# EAGLE design pet_csadapter-v1.1a (EAGLE 4.15)
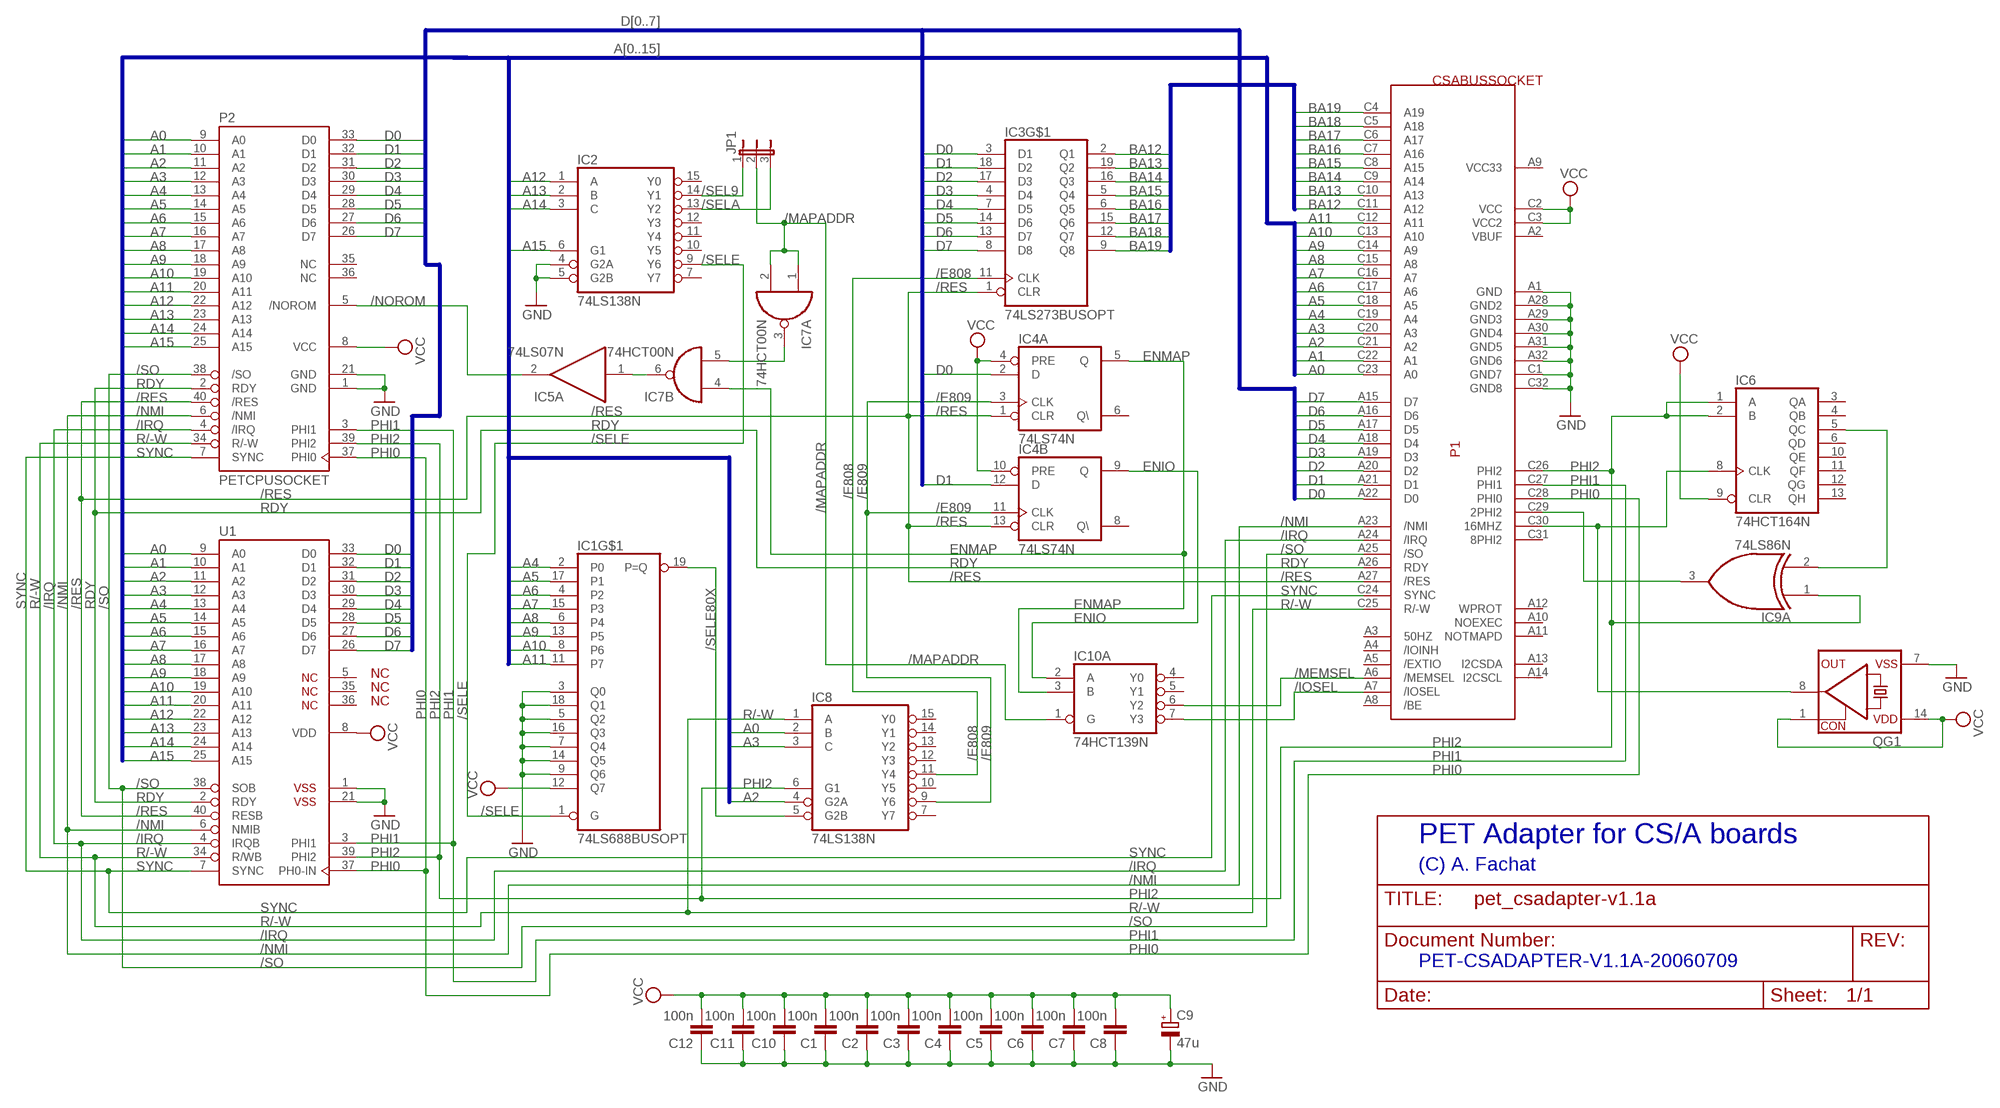
[diagram p0: schematic, sheet 1]

## Parts
C1  100n  C-EU025-025X050  [C025-025X050]
C2  100n  C-EU025-025X050  [C025-025X050]
C3  100n  C-EU025-025X050  [C025-025X050]
C4  100n  C-EU025-025X050  [C025-025X050]
C5  100n  C-EU025-025X050  [C025-025X050]
C6  100n  C-EU025-025X050  [C025-025X050]
C7  100n  C-EU025-025X050  [C025-025X050]
C8  100n  C-EU025-025X050  [C025-025X050]
C9  47u  CPOL-EUE2.5-5  [E2,5-5]
C10  100n  C-EU025-025X050  [C025-025X050]
C11  100n  C-EU025-025X050  [C025-025X050]
C12  100n  C-EU025-025X050  [C025-025X050]
IC1  74LS688BUSOPT  [DIL20]
IC2  74LS138N  [DIL16]
IC3  74LS273BUSOPT  [DIL20]
IC4  74LS74N  [DIL14]
IC5  74LS07N  [DIL14]
IC6  74HCT164N  [DIL14]
IC7  74HCT00N  [DIL14]
IC8  74LS138N  [DIL16]
IC9  74LS86N  [DIL14]
IC10  74HCT139N  [DIL16]
JP1  JP2E  [JP2]
P1  CSABUSSOCKET  [CSABUSSOCK]
P2  PETCPUSOCKET  [DIL40]
QG1  CRYSTAL_RES-SG51  [SG51]
U1  G65SC02P  [DIP-40]

## Nets
/E808: IC3.11(CLK) IC8.11(Y4)
/E809: IC4.3(A:CLK) IC4.11(B:CLK) IC8.9(Y6)
/IOSEL: IC10.7(A:Y3) P1.A7(/IOSEL)
/IRQ: P1.A24(/IRQ) P2.4(/IRQ) U1.4(IRQB)
/MAPADDR: IC7.1(A:I0) IC7.2(A:I1) IC10.1(A:G) JP1.2
/MEMSEL: IC10.6(A:Y2) P1.A6(/MEMSEL)
/NMI: P1.A23(/NMI) P2.6(/NMI) U1.6(NMIB)
/NOROM: IC5.2(A:O) P2.5(/NOROM)
/RES: IC3.1(CLR) IC4.1(A:CLR) IC4.13(B:CLR) P1.A27(/RES) P2.40(/RES) U1.40(RESB)
/SEL9: IC2.14(Y1) JP1.1
/SELA: IC2.13(Y2) JP1.3
/SELE: IC1.1(G) IC2.9(Y6)
/SELE80X: IC1.19(P=Q) IC8.5(G2B)
/SO: P1.A25(/SO) P2.38(/SO) U1.38(SOB)
A0: IC8.2(B) P1.C23(A0) P2.9(A0) U1.9(A0)
A1: P1.C22(A1) P2.10(A1) U1.10(A1)
A2: IC8.4(G2A) P1.C21(A2) P2.11(A2) U1.11(A2)
A3: IC8.3(C) P1.C20(A3) P2.12(A3) U1.12(A3)
A4: IC1.2(P0) P1.C19(A4) P2.13(A4) U1.13(A4)
A5: IC1.17(P1) P1.C18(A5) P2.14(A5) U1.14(A5)
A6: IC1.4(P2) P1.C17(A6) P2.15(A6) U1.15(A6)
A7: IC1.15(P3) P1.C16(A7) P2.16(A7) U1.16(A7)
A8: IC1.6(P4) P1.C15(A8) P2.17(A8) U1.17(A8)
A9: IC1.13(P5) P1.C14(A9) P2.18(A9) U1.18(A9)
A10: IC1.8(P6) P1.C13(A10) P2.19(A10) U1.19(A10)
A11: IC1.11(P7) P1.C12(A11) P2.20(A11) U1.20(A11)
A12: IC2.1(A) P2.22(A12) U1.22(A12)
A13: IC2.2(B) P2.23(A13) U1.23(A13)
A14: IC2.3(C) P2.24(A14) U1.24(A14)
A15: IC2.6(G1) P2.25(A15) U1.25(A15)
BA12: IC3.2(Q1) P1.C11(A12)
BA13: IC3.19(Q2) P1.C10(A13)
BA14: IC3.16(Q3) P1.C9(A14)
BA15: IC3.5(Q4) P1.C8(A15)
BA16: IC3.6(Q5) P1.C7(A16)
BA17: IC3.15(Q6) P1.C6(A17)
BA18: IC3.12(Q7) P1.C5(A18)
BA19: IC3.9(Q8) P1.C4(A19)
D0: IC3.3(D1) IC4.2(A:D) P1.A22(D0) P2.33(D0) U1.33(D0)
D1: IC3.18(D2) IC4.12(B:D) P1.A21(D1) P2.32(D1) U1.32(D1)
D2: IC3.17(D3) P1.A20(D2) P2.31(D2) U1.31(D2)
D3: IC3.4(D4) P1.A19(D3) P2.30(D3) U1.30(D3)
D4: IC3.7(D5) P1.A18(D4) P2.29(D4) U1.29(D4)
D5: IC3.14(D6) P1.A17(D5) P2.28(D5) U1.28(D5)
D6: IC3.13(D7) P1.A16(D6) P2.27(D6) U1.27(D6)
D7: IC3.8(D8) P1.A15(D7) P2.26(D7) U1.26(D7)
ENIO: IC4.9(B:Q) IC10.2(A:A)
ENMAP: IC4.5(A:Q) IC7.4(B:I0) IC10.3(A:B)
GND: C1.1 C2.1 C3.1 C4.1 C5.1 C6.1 C7.1 C8.1 C9.- C10.1 C11.1 C12.1 IC1.3(Q0) IC1.5(Q2) IC1.7(Q4) IC1.9(Q6) IC1.14(Q5) IC1.16(Q3) IC1.18(Q1) IC2.4(G2A) IC2.5(G2B) P1.A1(GND) P1.A28(GND2) P1.A29(GND3) P1.A30(GND4) P1.A31(GND5) P1.A32(GND6) P1.C1(GND7) P1.C32(GND8) P2.1(GND) P2.21(GND) QG1.7(VSS) U1.1(VSS$1) U1.21(VSS$2)
N$1: IC6.8(CLK) P1.C30(16MHZ) QG1.8(OUT)
N$4: IC9.3(A:O) P1.C29(2PHI2)
N$5: IC6.5(QC) IC9.2(A:I1)
N$7: IC5.1(A:I) IC7.6(B:O)
N$9: IC7.3(A:O) IC7.5(B:I1)
PHI0: P1.C28(PHI0) P2.37(PHI0) U1.37(PH0-IN)
PHI1: P1.C27(PHI1) P2.3(PHI1) U1.3(PHI1)
PHI2: IC6.1(A) IC6.2(B) IC8.6(G1) IC9.1(A:I0) P1.C26(PHI2) P2.39(PHI2) U1.39(PHI2)
R/-W: IC8.1(A) P1.C25(R/-W) P2.34(R/-W) U1.34(R/WB)
RDY: P1.A26(RDY) P2.2(RDY) U1.2(RDY)
SYNC: P1.C24(SYNC) P2.7(SYNC) U1.7(SYNC)
VCC: C1.2 C2.2 C3.2 C4.2 C5.2 C6.2 C7.2 C8.2 C9.+ C10.2 C11.2 C12.2 IC1.12(Q7) IC4.4(A:PRE) IC4.10(B:PRE) IC6.9(CLR) P1.C2(VCC) P1.C3(VCC2) P2.8(VCC) QG1.1(CON) QG1.14(VDD) U1.8(VDD)
Unconnected: IC2.7(Y7) IC2.10(Y5) IC2.11(Y4) IC2.12(Y3) IC2.15(Y0) IC4.6(A:Q\) IC4.8(B:Q\) IC5.3(B:I) IC5.4(B:O) IC5.5(C:I) IC5.6(C:O) IC5.8(D:O) IC5.9(D:I) IC5.10(E:O) IC5.11(E:I) IC5.12(F:O) IC5.13(F:I) IC6.3(QA) IC6.4(QB) IC6.6(QD) IC6.10(QE) IC6.11(QF) IC6.12(QG) IC6.13(QH) IC7.8(C:O) IC7.9(C:I0) IC7.10(C:I1) IC7.11(D:O) IC7.12(D:I0) IC7.13(D:I1) IC8.7(Y7) IC8.10(Y5) IC8.12(Y3) IC8.13(Y2) IC8.14(Y1) IC8.15(Y0) IC9.4(B:I0) IC9.5(B:I1) IC9.6(B:O) IC9.8(C:O) IC9.9(C:I0) IC9.10(C:I1) IC9.11(D:O) IC9.12(D:I0) IC9.13(D:I1) IC10.4(A:Y0) IC10.5(A:Y1) IC10.9(B:Y3) IC10.10(B:Y2) IC10.11(B:Y1) IC10.12(B:Y0) IC10.13(B:B) IC10.14(B:A) IC10.15(B:G) P1.A2(VBUF) P1.A3(50HZ) P1.A4(/IOINH) P1.A5(/EXTIO) P1.A8(/BE) P1.A9(VCC33) P1.A10(NOEXEC) P1.A11(NOTMAPD) P1.A12(WPROT) P1.A13(I2CSDA) P1.A14(I2CSCL) P1.C31(8PHI2) P2.35(NC) P2.36(NC) U1.5(NC$1) U1.35(NC$2) U1.36(NC$3)

## Buses
D[0..7]
A[0..15]
BA[12..19]

## Notes on the sheet
- PET Adapter for CS/A boards
- (C) A. Fachat
- PET-CSADAPTER-V1.1A-20060709

## Power pins joined to a net without a drawn wire
GND: IC1.10(GND) IC2.8(GND) IC3.10(GND) IC4.7(P:GND) IC5.7(P:GND) IC6.7(GND) IC7.7(P:GND) IC8.8(GND) IC9.7(P:GND) IC10.8(P:GND)
VCC: IC1.20(VCC) IC2.16(VCC) IC3.20(VCC) IC4.14(P:VCC) IC5.14(P:VCC) IC6.14(VCC) IC7.14(P:VCC) IC8.16(VCC) IC9.14(P:VCC) IC10.16(P:VCC)

## Library data of the parts
C1-C8 C10-C12 = rcl:C-EU: CAPACITOR, European symbol
C9 = rcl:CPOL-EU: POLARIZED CAPACITOR, European symbol
IC1 = csa:74LS688BUSOPT
IC2 IC8 = 74xx-us:74*138: 3-line to 8-line DECODER/DEMULTIPLEXER
IC3 = csa:74LS273BUSOPT
IC4 = 74xx-us:74*74: Dual D type positive edge triggered FLIP FLOP, preset and clear
IC5 = 74xx-eu:74*07: Hex BUFFER, open collector high-voltage output
IC6 = 74xx-eu:74*164: 8-bit parallel out SHIFT REGISTER
IC7 = 74xx-eu:74*00: Quad 2-input NAND gate
IC9 = 74xx-us:74*86: Quad 2-input EXCLUSIV-OR (XOR) gate
IC10 = 74xx-eu:74*139: Dual 2-line to 4-line DECODER/DEMULTIPLEXER
JP1 = jumper:JP2E: JUMPER
P1 = csa:CSABUS
P2 = csa:PETCPUSOCKET
QG1 = crystal:CRYSTAL_RES-: CRYSTAL RESONATOR
U1 = 65xxx:G65SC02P: California Micro Devices Version

## Board
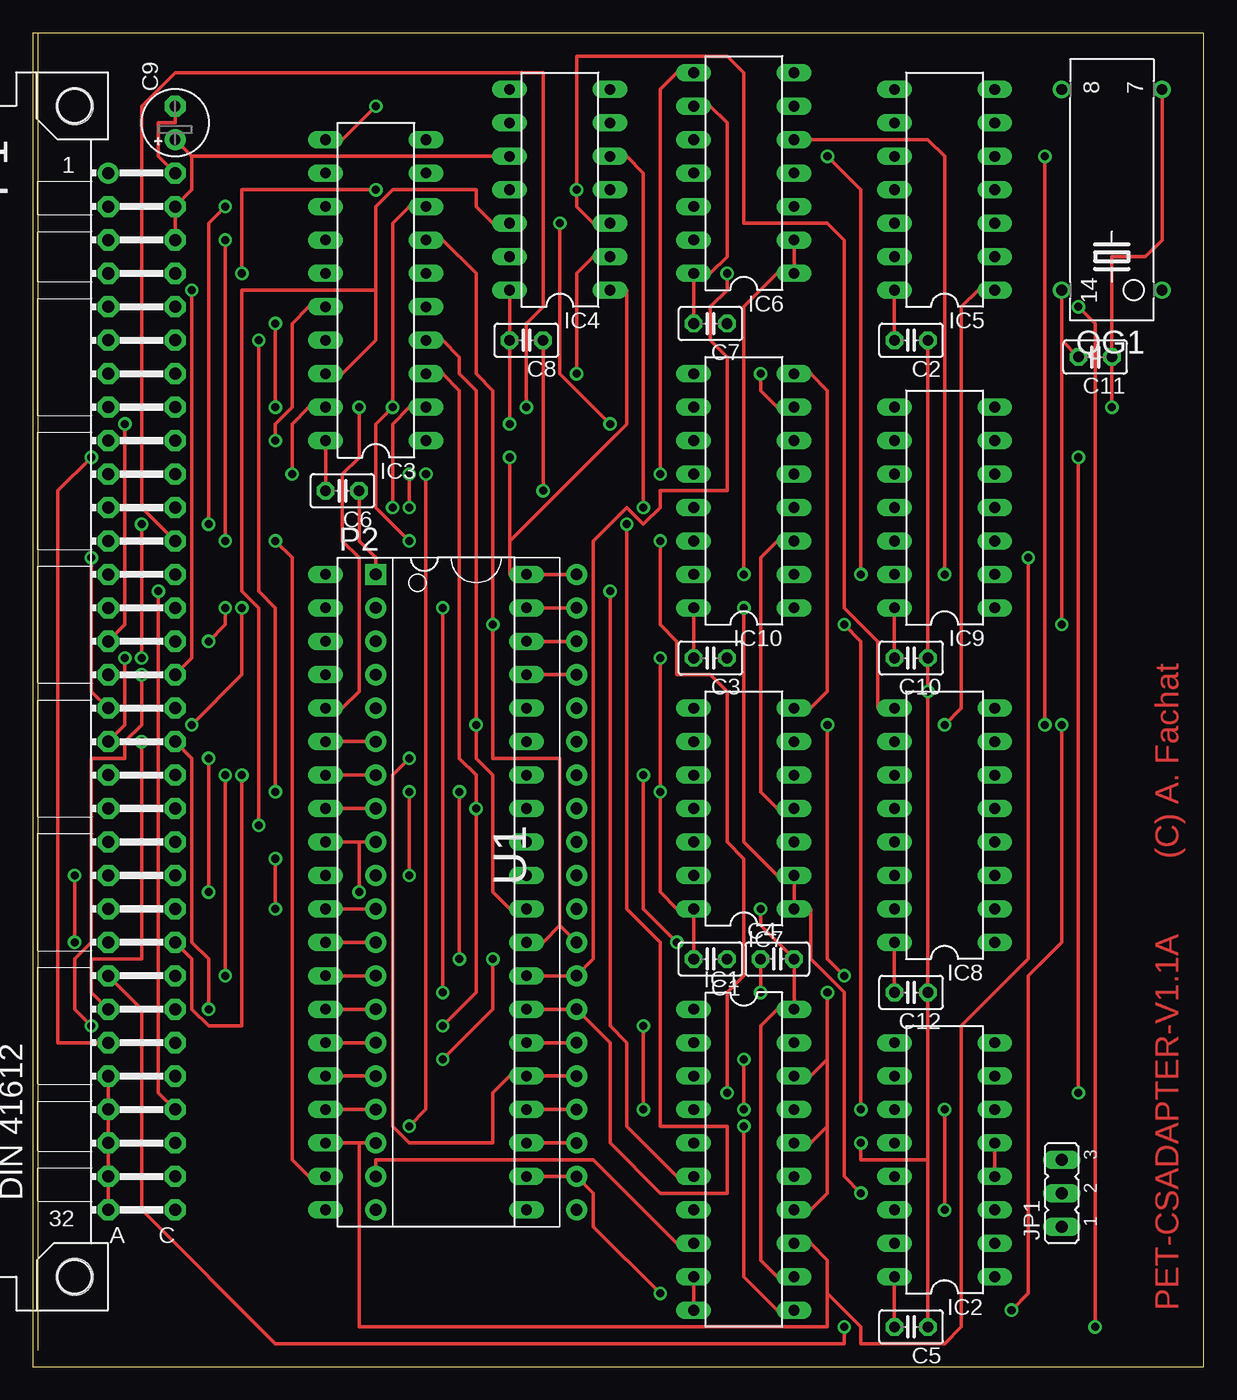
[diagram p1: board, top side]
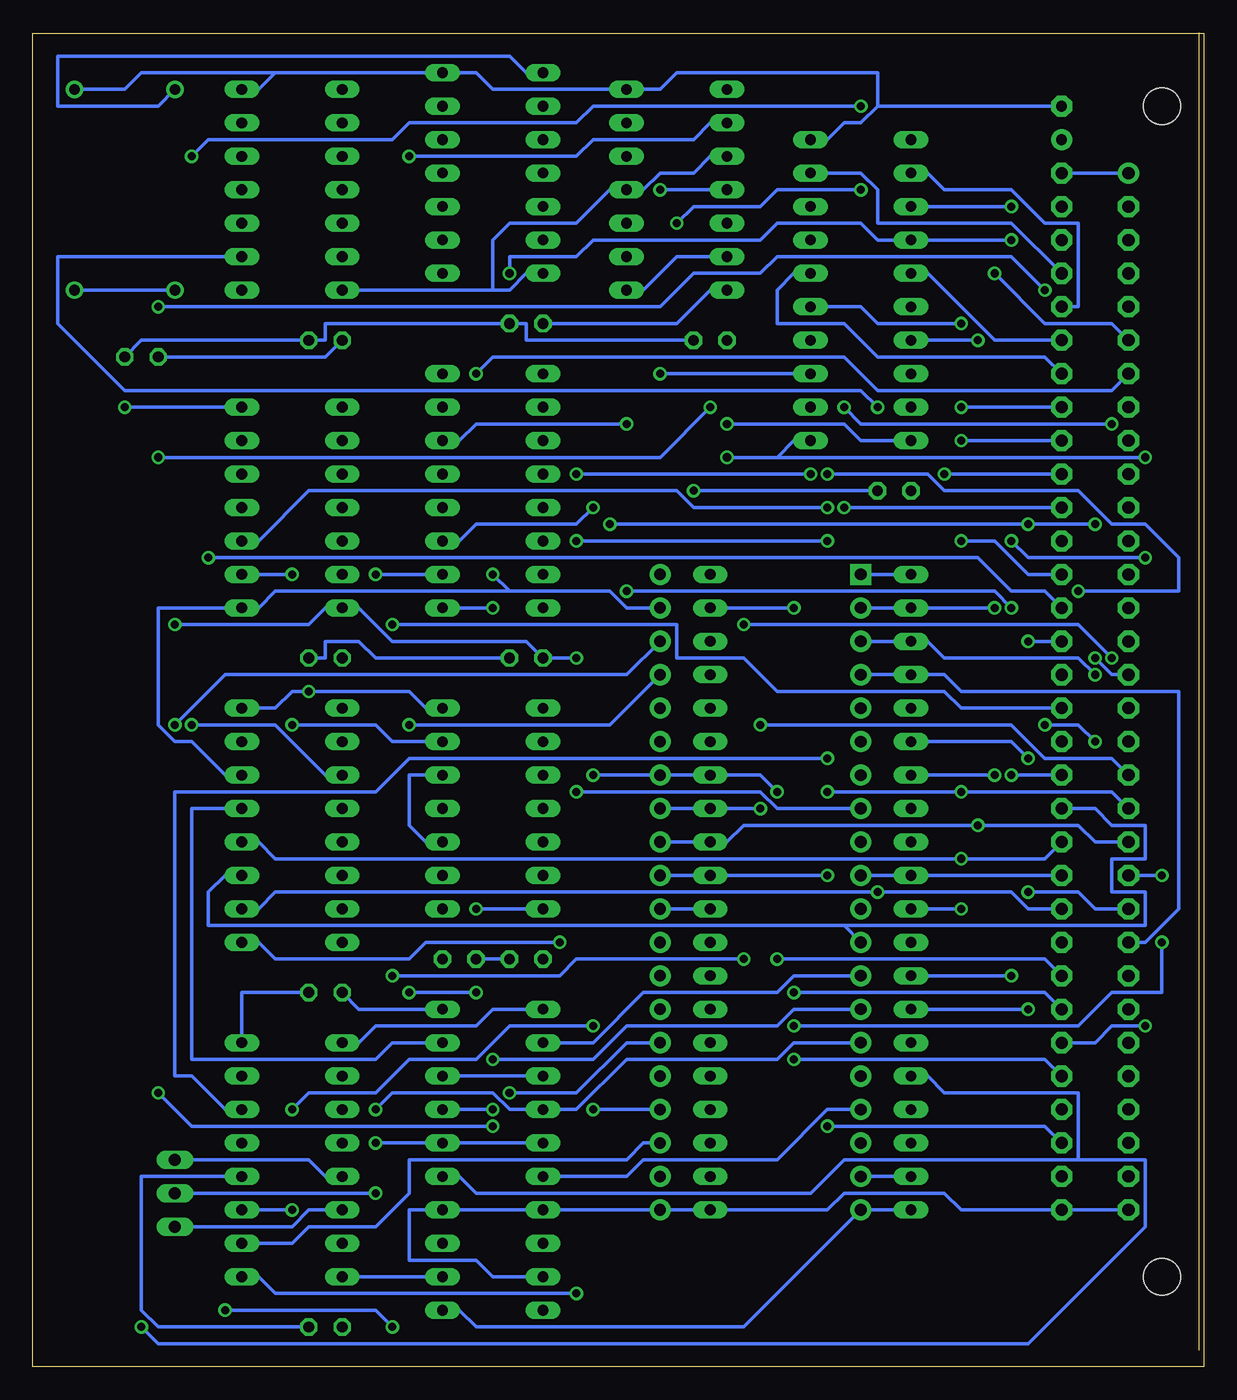
[diagram p2: board, bottom side, seen from below]

Size 88.88 x 101.28 mm. Coordinates in mm from the lower left corner, seen from the top.
Outline: 0,0 88.88,0 88.88,101.27 0,101.27 0,0
Copper layers (1*16): Top 0.035mm / dielectric 1.5mm / Bottom 0.035mm
Design rules "default": minimum track width 10mil, minimum drill 24mil, track to track 8mil, track to pad 8mil, pad to pad 8mil, via to via 8mil, smd to smd 8mil, copper to edge 40mil, drill to drill 8mil, minimum pad ring 10mil, minimum via ring 8mil, stop-mask expansion 4mil, vias tented up to drill 0mil, thermal gap 10mil

### Footprints (pad centres in the part's own frame; a part is rotated, then mirrored left to right if it is on the bottom)
C025-025X050 = drill 0.813 octagon: 1 -1.27,0; 2 1.27,0
E2,5-5 = drill 0.813 pad 1.6 round: + -1.27,0 | drill 0.813 pad 1.6 octagon: - 1.27,0
DIL20 = drill 0.813 long: 1 -10.16,-3.81; 2 -7.62,-3.81; 3 -5.08,-3.81; 4 -2.54,-3.81; 5 0,-3.81; 6 2.54,-3.81; 7 5.08,-3.81; 8 7.62,-3.81; 9 10.16,-3.81; 10 12.7,-3.81; 11 12.7,3.81; 12 10.16,3.81; 13 7.62,3.81; 14 5.08,3.81; 15 2.54,3.81; 16 0,3.81; 17 -2.54,3.81; 18 -5.08,3.81; 19 -7.62,3.81; 20 -10.16,3.81
DIL16 = drill 0.813 long: 1 -8.89,-3.81; 2 -6.35,-3.81; 3 -3.81,-3.81; 4 -1.27,-3.81; 5 1.27,-3.81; 6 3.81,-3.81; 7 6.35,-3.81; 8 8.89,-3.81; 9 8.89,3.81; 10 6.35,3.81; 11 3.81,3.81; 12 1.27,3.81; 13 -1.27,3.81; 14 -3.81,3.81; 15 -6.35,3.81; 16 -8.89,3.81
DIL14 = drill 0.813 long: 1 -7.62,-3.81; 2 -5.08,-3.81; 3 -2.54,-3.81; 4 0,-3.81; 5 2.54,-3.81; 6 5.08,-3.81; 7 7.62,-3.81; 8 7.62,3.81; 9 5.08,3.81; 10 2.54,3.81; 11 0,3.81; 12 -2.54,3.81; 13 -5.08,3.81; 14 -7.62,3.81
JP2 = drill 0.914 long: 1 -2.54,0; 2 0,0; 3 2.54,0
CSABUSSOCK = drill 0.914 pad 1.6 round: A1 -7.62,-39.37 | drill 0.914 pad 1.6 octagon: A2 -7.62,-36.83; A3 -7.62,-34.29; A4 -7.62,-31.75; A5 -7.62,-29.21; A6 -7.62,-26.67; A7 -7.62,-24.13; A8 -7.62,-21.59; A9 -7.62,-19.05; A10 -7.62,-16.51; A11 -7.62,-13.97; A12 -7.62,-11.43; A13 -7.62,-8.89; A14 -7.62,-6.35; A15 -7.62,-3.81; A16 -7.62,-1.27; A17 -7.62,1.27; A18 -7.62,3.81; A19 -7.62,6.35; A20 -7.62,8.89; A21 -7.62,11.43; A22 -7.62,13.97; A23 -7.62,16.51; A24 -7.62,19.05; A25 -7.62,21.59; A26 -7.62,24.13; A27 -7.62,26.67; A28 -7.62,29.21; A29 -7.62,31.75; A30 -7.62,34.29; A31 -7.62,36.83; A32 -7.62,39.37; C1 -12.7,-39.37; C2 -12.7,-36.83; C3 -12.7,-34.29; C4 -12.7,-31.75; C5 -12.7,-29.21; C6 -12.7,-26.67; C7 -12.7,-24.13; C8 -12.7,-21.59; C9 -12.7,-19.05; C10 -12.7,-16.51; C11 -12.7,-13.97; C12 -12.7,-11.43; C13 -12.7,-8.89; C14 -12.7,-6.35; C15 -12.7,-3.81; C16 -12.7,-1.27; C17 -12.7,1.27; C18 -12.7,3.81; C19 -12.7,6.35; C20 -12.7,8.89; C21 -12.7,11.43; C22 -12.7,13.97; C23 -12.7,16.51; C24 -12.7,19.05; C25 -12.7,21.59; C26 -12.7,24.13; C27 -12.7,26.67; C28 -12.7,29.21; C29 -12.7,31.75; C30 -12.7,34.29; C31 -12.7,36.83; C32 -12.7,39.37 | hole 2.794: -5.08,44.45; -5.08,-44.45
DIL40 = drill 0.813 long: 1 -16.51,-7.62; 2 -13.97,-7.62; 3 -11.43,-7.62; 4 -8.89,-7.62; 5 -6.35,-7.62; 6 -3.81,-7.62; 7 -1.27,-7.62; 8 1.27,-7.62; 9 3.81,-7.62; 10 6.35,-7.62; 11 8.89,-7.62; 12 11.43,-7.62; 13 13.97,-7.62; 14 16.51,-7.62; 15 19.05,-7.62; 16 21.59,-7.62; 17 24.13,-7.62; 18 26.67,-7.62; 19 29.21,-7.62; 20 31.75,-7.62; 21 31.75,7.62; 22 29.21,7.62; 23 26.67,7.62; 24 24.13,7.62; 25 21.59,7.62; 26 19.05,7.62; 27 16.51,7.62; 28 13.97,7.62; 29 11.43,7.62; 30 8.89,7.62; 31 6.35,7.62; 32 3.81,7.62; 33 1.27,7.62; 34 -1.27,7.62; 35 -3.81,7.62; 36 -6.35,7.62; 37 -8.89,7.62; 38 -11.43,7.62; 39 -13.97,7.62; 40 -16.51,7.62
SG51 = drill 0.813 round: 1 -7.62,-3.81; 7 7.62,-3.81; 8 7.62,3.81; 14 -7.62,3.81
DIP-40 = drill 0.889 pad 1.6 square: 1 -22.86,-7.62 | drill 0.889 pad 1.6 round: 2 -20.32,-7.62; 3 -17.78,-7.62; 4 -15.24,-7.62; 5 -12.7,-7.62; 6 -10.16,-7.62; 7 -7.62,-7.62; 8 -5.08,-7.62; 9 -2.54,-7.62; 10 0,-7.62; 11 2.54,-7.62; 12 5.08,-7.62; 13 7.62,-7.62; 14 10.16,-7.62; 15 12.7,-7.62; 16 15.24,-7.62; 17 17.78,-7.62; 18 20.32,-7.62; 19 22.86,-7.62; 20 25.4,-7.62; 21 25.4,7.62; 22 22.86,7.62; 23 20.32,7.62; 24 17.78,7.62; 25 15.24,7.62; 26 12.7,7.62; 27 10.16,7.62; 28 7.62,7.62; 29 5.08,7.62; 30 2.54,7.62; 31 0,7.62; 32 -2.54,7.62; 33 -5.08,7.62; 34 -7.62,7.62; 35 -10.16,7.62; 36 -12.7,7.62; 37 -15.24,7.62; 38 -17.78,7.62; 39 -20.32,7.62; 40 -22.86,7.62

### Placement (x,y rotation side)
C1  51.43,30.95 180 top
C2  66.67,77.94 180 top
C3  51.43,53.81 180 top
C4  56.51,30.95 0 top
C5  66.67,3.01 180 top
C6  23.49,66.51 180 top
C7  51.43,79.21 180 top
C8  37.46,77.94 180 top
C9  10.79,94.45 90 top
C10  66.67,53.81 180 top
C11  80.64,76.67 180 top
C12  66.67,28.41 180 top
IC1  53.97,16.98 270 top
IC2  69.21,15.71 90 top
IC3  26.03,80.48 90 top
IC4  40,89.37 90 top
IC5  69.21,89.37 90 top
IC6  53.97,90.64 90 top
IC7  53.97,42.38 90 top
IC8  69.21,41.11 90 top
IC9  69.21,65.24 90 top
IC10  53.97,66.51 90 top
JP1  78.1,13.17 90 top
P1  -1.91,51.27 180 top
P2  29.84,43.65 270 top
QG1  81.91,89.37 90 top
U1  33.65,37.3 270 top

### Tracks (layer width: path | path; a pad name or v marks a point on that pad's centre or on a via)
/E808  (via drill 0.61)
  Top 0.254: v76.83,48.73 v76.83,91.91 | v26.03,95.72 23.49,93.18 IC3.11
  Bottom 0.254: v76.83,48.73 70.48,48.73 66.67,44.92 IC8.11 | v76.83,91.91 75.56,93.18 61.59,93.18 60.32,94.45 47.62,94.45 46.35,95.72 v26.03,95.72
/E809  (via drill 0.61)
  Top 0.254: IC4.3 42.54,86.83 41.27,88.1 v41.27,89.37 41.27,99.53 52.7,99.53 53.97,98.26 53.97,86.83 60.32,86.83 61.59,85.56 61.59,57.62 64.13,55.08 64.13,50 IC8.9
  Bottom 0.254: v41.27,89.37 IC4.11
/IOSEL  (via drill 0.61)
  Top 0.254: v55.24,75.4 55.24,74.13 56.51,72.86 IC10.7
  Bottom 0.254: v55.24,75.4 53.97,76.67 27.3,76.67 24.76,74.13 6.98,74.13 P1.A7
/IRQ
  Bottom 0.254: U1.4 P2.4 19.68,52.54 18.41,51.27 1.9,51.27 1.9,34.76 4.44,32.22 P1.A24
/MAPADDR  (via drill 0.61)
  Top 0.254: v53.97,57.62 53.97,39.84 56.51,37.3 IC7.2 IC7.1 59.05,34.76 59.05,30.95 61.59,28.41 61.59,14.44 v62.86,13.17
  Bottom 0.254: v53.97,57.62 IC10.1 | v62.86,13.17 JP1.2
/MEMSEL  (via drill 0.61)
  Top 0.254: v43.81,71.59 40,75.4 v40,86.83 | v26.03,89.37 15.87,89.37 v15.87,83.02
  Bottom 0.254: v43.81,71.59 55.24,71.59 56.51,70.32 IC10.6 | v40,86.83 38.73,88.1 33.65,88.1 32.38,89.37 v26.03,89.37 | v15.87,83.02 12.06,79.21 6.98,79.21 P1.A6
/NMI  (via drill 0.61)
  Top 0.254: P2.6 U1.6 | v13.33,36.03 v13.33,46.19
  Bottom 0.254: P1.A23 8.25,34.76 9.52,36.03 v13.33,36.03 | v13.33,46.19 14.6,47.46 P2.6
/NOROM  (via drill 0.61)
  Top 0.254: v24.76,72.86 24.76,69.05 23.49,67.78 23.49,62.7 24.76,61.43 24.76,51.27 23.49,50 P2.5
  Bottom 0.254: v24.76,72.86 26.03,74.13 81.91,74.13 86.99,79.21 86.99,84.29 IC5.2
/RES  (via drill 0.61)
  Top 0.254: 36.19,62.7 36.19,60.16 P2.40 U1.40 | v36.19,69.05 36.19,62.7 | P1.A27 1.9,24.6 1.9,66.51 v4.44,69.05 | 36.19,62.7 45.08,71.59 45.08,81.75 IC4.1
  Bottom 0.254: IC4.13 40,84.29 42.54,81.75 IC4.1 | 32.38,69.05 31.11,70.32 IC3.1 | 32.38,69.05 v36.19,69.05 | v4.44,69.05 32.38,69.05
/SEL9
  Bottom 0.254: IC2.14 67.94,11.9 69.21,10.63 JP1.1
/SELA
  Bottom 0.254: IC2.13 66.67,14.44 67.94,15.71 JP1.3
/SELE
  Bottom 0.254: IC1.1 53.97,27.14 55.24,25.87 62.86,25.87 64.13,24.6 IC2.9
/SELE80X
  Bottom 0.254: IC1.19 61.59,24.6 62.86,23.33 76.83,23.33 76.83,42.38 IC8.5
/SO  (via drill 0.61)
  Top 0.254: U1.38 P2.38 | P1.A25 8.25,27.14 8.25,11.9 18.41,1.74 61.59,1.74 v61.59,3.01 | v74.29,4.28 75.56,5.55 75.56,29.68 78.1,32.22 v78.1,48.73
  Bottom 0.254: v61.59,3.01 62.86,4.28 v74.29,4.28 | v78.1,48.73 74.29,52.54 43.81,52.54 U1.38
A0  (via drill 0.61)
  Top 0.254: 24.76,39.84 U1.9 | 24.76,39.84 P2.9 | v24.76,36.03 24.76,39.84
  Bottom 0.254: P1.C23 13.33,34.76 14.6,36.03 v24.76,36.03 70.48,36.03 71.75,34.76 IC8.2
A1
  Bottom 0.254: U1.10 P2.10 P1.C22
A2  (via drill 0.61)
  Top 0.254: P2.11 U1.11 | v18.41,38.57 v18.41,34.76
  Bottom 0.254: P1.C21 12.06,38.57 v18.41,38.57 70.48,38.57 71.75,39.84 IC8.4 | v18.41,34.76 P2.11
A3
  Top 0.254: U1.12 P2.12
  Bottom 0.254: 27.3,33.49 75.56,33.49 75.56,36.03 74.29,37.3 IC8.3 | 27.3,33.49 U1.12 | P1.C20 8.25,42.38 6.98,41.11 4.44,41.11 4.44,38.57 6.98,38.57 6.98,36.03 4.44,36.03 4.44,33.49 27.3,33.49
A4  (via drill 0.61)
  Top 0.254: P2.13 U1.13 | v14.6,29.68 v14.6,44.92
  Bottom 0.254: U1.13 31.11,29.68 32.38,28.41 42.54,28.41 46.35,24.6 IC1.2 | v14.6,44.92 P1.C19 | v14.6,29.68 P2.13
A5  (via drill 0.61)
  Top 0.254: P2.14 U1.14 | v53.97,23.33 v53.97,19.52 | P1.C18 12.06,46.19 12.06,32.22 13.33,30.95 v13.33,27.14
  Bottom 0.254: v53.97,23.33 46.35,23.33 43.81,25.87 32.38,25.87 31.11,27.14 U1.14 | v53.97,19.52 IC1.17 | v13.33,27.14 P2.14
A6  (via drill 0.61)
  Top 0.254: P2.15 U1.15 | v61.59,56.35 62.86,55.08 v62.86,19.52
  Bottom 0.254: U1.15 31.11,24.6 32.38,23.33 43.81,23.33 47.62,19.52 IC1.4 52.7,19.52 53.97,20.79 61.59,20.79 v62.86,19.52 | P1.C17 18.41,50 19.68,51.27 32.38,51.27 34.92,53.81 40,53.81 40,56.35 v61.59,56.35
A7  (via drill 0.61)
  Top 0.254: P2.16 U1.16 | P1.C16 12.06,53.81 v12.06,81.75 | v79.37,80.48 80.64,79.21 v80.64,3.01
  Bottom 0.254: 9.52,15.71 27.3,15.71 29.84,13.17 55.24,13.17 56.51,14.44 IC1.15 | 9.52,15.71 9.52,20.79 19.68,20.79 20.95,22.06 P2.16 | v12.06,81.75 14.6,84.29 32.38,84.29 33.65,83.02 38.73,83.02 41.27,80.48 v79.37,80.48 | v80.64,3.01 79.37,1.74 13.33,1.74 4.44,10.63 4.44,15.71 9.52,15.71
A8  (via drill 0.61)
  Top 0.254: P2.17 U1.17 | v13.33,55.08 14.6,56.35 v14.6,57.62 | v43.81,58.89 43.81,25.87 45.08,24.6 45.08,18.25 48.89,14.44 IC1.6
  Bottom 0.254: U1.17 28.57,19.52 32.38,15.71 42.54,15.71 43.81,14.44 IC1.6 | v13.33,55.08 P1.C15 | v14.6,57.62 15.87,58.89 v43.81,58.89
A9  (via drill 0.61)
  Top 0.254: 24.76,16.98 U1.18 | 24.76,16.98 P2.18 | 60.32,5.55 60.32,3.01 24.76,3.01 24.76,16.98 | 60.32,5.55 60.32,8.09 59.05,9.36 IC1.13 | v75.56,61.43 75.56,30.95 70.48,25.87 70.48,3.01 69.21,1.74 62.86,1.74 62.86,3.01 60.32,5.55
  Bottom 0.254: P1.C14 12.06,58.89 14.6,58.89 17.14,61.43 v75.56,61.43
A10  (via drill 0.61)
  Top 0.254: U1.19 26.03,15.71 42.54,15.71 48.89,9.36 IC1.8 | v18.41,62.7 19.68,61.43 19.68,15.71 20.95,14.44 P2.19
  Bottom 0.254: P2.19 U1.19 | P1.C13 13.33,60.16 15.87,62.7 v18.41,62.7
A11  (via drill 0.61)
  Top 0.254: P1.C12 8.25,65.24 8.25,95.72 10.79,98.26 38.73,98.26 38.73,80.48 37.46,79.21 v37.46,72.86 | v79.37,20.79 v79.37,69.05 | v53.97,18.25 53.97,6.82 56.51,4.28 IC1.11
  Bottom 0.254: P2.20 U1.20 34.92,3.01 55.24,3.01 56.51,4.28 IC1.11 | v37.46,72.86 41.27,69.05 v79.37,69.05 | v79.37,20.79 76.83,18.25 v53.97,18.25
A12  (via drill 0.61)
  Top 0.254: v47.62,5.55 42.54,10.63 42.54,13.17 U1.22 P2.22
  Bottom 0.254: v47.62,5.55 70.48,5.55 71.75,6.82 IC2.1
A13
  Top 0.254: P2.23 U1.23
  Bottom 0.254: U1.23 42.54,16.98 43.81,15.71 60.32,15.71 60.32,13.17 62.86,10.63 67.94,10.63 69.21,9.36 IC2.2
A14  (via drill 0.61)
  Top 0.254: v69.21,19.52 v69.21,11.9 | v46.35,19.52 v46.35,25.87 | P2.24 U1.24
  Bottom 0.254: v69.21,19.52 67.94,20.79 62.86,20.79 60.32,23.33 55.24,23.33 52.7,25.87 v46.35,25.87 | U1.24 v46.35,19.52 | v69.21,11.9 IC2.3
A15  (via drill 0.61)
  Top 0.254: U1.25 P2.25 36.19,22.06 34.92,20.79 34.92,16.98 28.57,16.98 27.3,18.25 27.3,44.92 v28.57,46.19
  Bottom 0.254: v28.57,46.19 60.32,46.19 62.86,43.65 78.1,43.65 78.1,22.06 76.83,22.06 74.29,19.52 IC2.6
BA12  (via drill 0.61)
  Top 0.254: v27.3,65.24 27.3,71.59 28.57,72.86 IC3.2
  Bottom 0.254: P1.C11 v27.3,65.24
BA13  (via drill 0.61)
  Top 0.254: v19.68,67.78 19.68,71.59 20.95,72.86 IC3.19
  Bottom 0.254: P1.C10 v19.68,67.78
BA14  (via drill 0.61)
  Top 0.254: v18.41,70.32 18.41,71.59 19.68,72.86 19.68,79.21 20.95,80.48 IC3.16
  Bottom 0.254: P1.C9 v18.41,70.32
BA15  (via drill 0.61)
  Top 0.254: v18.41,72.86 v18.41,79.21
  Bottom 0.254: v18.41,79.21 24.76,79.21 26.03,80.48 IC3.5 | P1.C8 v18.41,72.86
BA16
  Bottom 0.254: P1.C7 12.06,76.67 24.76,76.67 27.3,79.21 32.38,79.21 32.38,81.75 31.11,83.02 IC3.6
BA17
  Bottom 0.254: P1.C6 15.87,77.94 20.95,83.02 IC3.15
BA18
  Bottom 0.254: P1.C5 9.52,80.48 9.52,86.83 12.06,86.83 14.6,89.37 19.68,89.37 20.95,90.64 IC3.12
BA19
  Bottom 0.254: P1.C4 14.6,86.83 24.76,86.83 24.76,89.37 26.03,90.64 IC3.9
D0  (via drill 0.61)
  Top 0.254: v41.27,75.4 41.27,83.02 42.54,84.29 IC4.2 | v3.17,32.22 v3.17,37.3 | v31.11,25.87 33.65,28.41 v33.65,42.38 33.65,44.92 32.38,46.19 32.38,74.13 31.11,75.4 IC3.3
  Bottom 0.254: U1.33 P2.33 v33.65,42.38 | IC3.3 v41.27,75.4 | v3.17,37.3 P1.A22 | v3.17,32.22 3.17,28.41 6.98,28.41 9.52,25.87 v31.11,25.87
D1  (via drill 0.61)
  Top 0.254: 26.03,81.75 26.03,88.1 27.3,89.37 33.65,89.37 33.65,88.1 34.92,86.83 IC4.12 | 26.03,81.75 26.03,77.94 23.49,75.4 IC3.18 | 26.03,81.75 15.87,81.75 15.87,58.89 17.14,57.62 v17.14,41.11
  Bottom 0.254: U1.32 P2.32 36.19,39.84 34.92,41.11 v17.14,41.11 9.52,41.11 8.25,39.84 P1.A21
D2  (via drill 0.61)
  Top 0.254: v17.14,77.94 17.14,58.89 18.41,57.62 v18.41,43.65 | v28.57,43.65 v28.57,37.3
  Bottom 0.254: U1.31 P2.31 v28.57,37.3 | P1.A20 6.98,43.65 v18.41,43.65 v28.57,43.65 | v17.14,77.94 IC3.17
D3  (via drill 0.61)
  Top 0.254: IC3.4 31.11,77.94 32.38,76.67 32.38,75.4 33.65,74.13 v33.65,48.73 33.65,46.19 34.92,44.92 34.92,36.03 36.19,34.76 P2.30
  Bottom 0.254: P2.30 U1.30 | P1.A19 6.98,46.19 12.06,46.19 14.6,48.73 v33.65,48.73
D4  (via drill 0.61)
  Top 0.254: 40,33.49 40,46.19 34.92,46.19 v34.92,56.35 34.92,74.13 33.65,75.4 33.65,83.02 31.11,85.56 IC3.7 | 40,33.49 38.73,32.22 P2.29 | P1.A18 6.98,48.73 v6.98,53.81 | 40,33.49 U1.29
  Bottom 0.254: v6.98,53.81 9.52,56.35 v34.92,56.35
D5  (via drill 0.61)
  Top 0.254: P2.28 U1.28 42.54,30.95 42.54,62.7 45.08,65.24 46.35,63.97 47.62,65.24 47.62,66.51 52.7,66.51 52.7,76.67 51.43,77.94 51.43,80.48 52.7,81.75 v52.7,83.02 | v14.6,62.7 v14.6,85.56 | v4.44,61.43 4.44,51.27 P1.A17
  Bottom 0.254: v14.6,62.7 13.33,61.43 v4.44,61.43 | v14.6,85.56 IC3.14 24.76,85.56 26.03,86.83 32.38,86.83 33.65,85.56 46.35,85.56 47.62,84.29 52.7,84.29 v52.7,83.02
D6  (via drill 0.61)
  Top 0.254: P2.27 U1.27 43.81,24.6 43.81,16.98 47.62,13.17 52.7,13.17 52.7,18.25 47.62,18.25 47.62,32.22 45.08,34.76 v45.08,63.97 | v14.6,88.1 13.33,86.83 v13.33,63.97 | v8.25,53.81 v8.25,63.97
  Bottom 0.254: v8.25,63.97 v13.33,63.97 v45.08,63.97 | v8.25,53.81 6.98,52.54 P1.A16 | v14.6,88.1 IC3.13
D7  (via drill 0.61)
  Top 0.254: U1.26 P2.26 | v6.98,71.59 6.98,56.35 P1.A15 | IC3.8 28.57,88.1 27.3,86.83 v27.3,72.86 26.03,71.59 26.03,65.24 v28.57,62.7 | v52.7,20.79 52.7,28.41 53.97,29.68 53.97,38.57 52.7,39.84 52.7,51.27 51.43,52.54 48.89,52.54 48.89,55.08 47.62,56.35 v47.62,62.7
  Bottom 0.254: v27.3,72.86 26.03,71.59 v6.98,71.59 | U1.26 43.81,24.6 47.62,20.79 v52.7,20.79 | v28.57,62.7 v47.62,62.7
ENIO  (via drill 0.61)
  Top 0.254: v60.32,91.91 62.86,89.37 v62.86,60.16
  Bottom 0.254: v60.32,91.91 47.62,91.91 46.35,93.18 38.73,93.18 37.46,94.45 IC4.9 | IC10.2 v62.86,60.16
ENMAP  (via drill 0.61)
  Top 0.254: IC7.4 56.51,42.38 55.24,43.65 55.24,61.43 56.51,62.7 IC10.3 | v46.35,65.24 46.35,90.64 45.08,91.91 IC4.5
  Bottom 0.254: v46.35,65.24 47.62,63.97 55.24,63.97 56.51,62.7 IC10.3
GND  (via drill 0.61)
  Top 0.254: P1.C1 9.52,91.91 9.52,94.45 10.79,94.45 C9.- | v55.24,28.41 C4.1 | 60.32,23.33 v60.32,28.41 | 60.32,23.33 59.05,22.06 IC1.18 | 60.32,18.25 59.05,16.98 IC1.16 | 60.32,18.25 60.32,23.33 | P1.A28 P1.A29 P1.A30 P1.A31 P1.A32 | IC1.9 IC1.10 | 60.32,18.25 60.32,13.17 59.05,11.9 IC1.14 | C6.1 24.76,62.7 26.03,61.43 U1.1 | C8.1 v38.73,66.51 | IC10.8 59.05,75.4 60.32,74.13 60.32,51.27 59.05,50 IC7.7 | IC2.4 IC2.5 | 67.94,15.71 C12.1 v67.94,51.27 C10.1 C2.1 | 67.94,15.71 C5.1 | v81.91,72.86 C11.1 81.91,84.29 84.45,84.29 85.72,85.56 QG1.7 | v62.86,16.98 62.86,15.71 67.94,15.71
  Bottom 0.254: P1.C1 P1.A1 | 24.76,95.72 26.03,94.45 27.3,94.45 28.57,93.18 IC3.10 | 24.76,95.72 C9.- | 70.48,98.26 71.75,96.99 IC5.7 | 70.48,98.26 IC6.7 55.24,98.26 53.97,96.99 IC4.7 41.27,96.99 40,98.26 24.76,98.26 24.76,95.72 | QG1.7 81.91,96.99 80.64,98.26 70.48,98.26 | IC1.5 IC1.16 v62.86,16.98 | C4.1 C1.1 | IC1.18 IC1.3 | v60.32,28.41 v55.24,28.41 | P1.A32 P1.C32 18.41,11.9 19.68,13.17 27.3,13.17 28.57,11.9 P2.21 U1.21 IC1.7 IC1.14 60.32,11.9 60.32,8.09 55.24,8.09 53.97,6.82 IC1.9 | U1.1 P2.1 | C8.1 51.43,77.94 51.43,79.21 C7.1 66.67,79.21 66.67,77.94 C2.1 80.64,77.94 C11.1 | v38.73,66.51 C6.1 | IC7.7 59.05,50 60.32,51.27 v67.94,51.27 69.21,51.27 70.48,50 IC8.8 | IC2.8 73.02,28.41 C12.1 | C5.1 79.37,3.01 80.64,4.28 80.64,14.44 IC2.4 | v81.91,72.86 IC9.7 | C3.1 62.86,53.81 64.13,55.08 66.67,55.08 66.67,53.81 C10.1
N$1  (via drill 0.61)
  Top 0.254: v28.57,18.25 29.84,19.52 v29.84,67.78 | v47.62,67.78 47.62,96.99 48.89,98.26 IC6.8
  Bottom 0.254: QG1.8 79.37,95.72 86.99,95.72 86.99,99.53 52.7,99.53 51.43,98.26 IC6.8 | P1.C30 12.06,18.25 v28.57,18.25 | v29.84,67.78 v47.62,67.78
N$4  (via drill 0.61)
  Top 0.254: v28.57,67.78 v28.57,65.24 | v9.52,58.89 9.52,20.79 P1.C29
  Bottom 0.254: v28.57,65.24 38.73,65.24 40,66.51 67.94,66.51 71.75,62.7 IC9.3 | v28.57,67.78 20.95,67.78 19.68,66.51 9.52,66.51 6.98,63.97 4.44,63.97 1.9,61.43 1.9,58.89 v9.52,58.89
N$5  (via drill 0.61)
  Top 0.254: v69.21,60.16 69.21,91.91 67.94,93.18 IC6.5
  Bottom 0.254: v69.21,60.16 IC9.2
N$7  (via drill 0.61)
  Top 0.254: v69.21,48.73 70.48,50 70.48,80.48 71.75,81.75 IC5.1
  Bottom 0.254: v69.21,48.73 62.86,48.73 61.59,47.46 IC7.6
N$9
  Bottom 0.254: IC7.3 59.05,39.84 60.32,41.11 60.32,44.92 IC7.5
PHI0  (via drill 0.61)
  Top 0.254: U1.37 P2.37 | v31.11,23.33 34.92,27.14 v34.92,30.95 | v61.59,29.68 60.32,30.95 v60.32,48.73
  Bottom 0.254: P1.C28 12.06,23.33 v31.11,23.33 | v34.92,30.95 47.62,30.95 48.89,29.68 v61.59,29.68 | v60.32,48.73 45.08,48.73 U1.37
PHI1  (via drill 0.61)
  Top 0.254: v4.44,25.87 3.17,27.14 3.17,30.95 4.44,32.22 4.44,46.19 6.98,46.19 6.98,47.46 8.25,48.73 v8.25,52.54
  Bottom 0.254: U1.3 P2.3 20.95,55.08 19.68,53.81 9.52,53.81 v8.25,52.54 | P1.C27 8.25,24.6 6.98,25.87 v4.44,25.87
PHI2  (via drill 0.61)
  Top 0.254: IC6.2 IC6.1 56.51,83.02 53.97,80.48 v53.97,60.16 | P2.39 U1.39 | v31.11,28.41 v31.11,57.62
  Bottom 0.254: IC8.6 74.29,44.92 76.83,47.46 78.1,47.46 79.37,48.73 79.37,57.62 IC9.1 71.75,57.62 70.48,58.89 52.7,58.89 | P1.C26 12.06,28.41 v31.11,28.41 | v31.11,57.62 P2.39 | 52.7,58.89 v53.97,60.16 | 52.7,58.89 45.08,58.89 43.81,57.62 U1.39
R/-W  (via drill 0.61)
  Top 0.254: v48.89,32.22 46.35,34.76 v46.35,44.92 | v32.38,30.95 v32.38,43.65
  Bottom 0.254: v48.89,32.22 59.05,32.22 60.32,30.95 70.48,30.95 71.75,32.22 IC8.1 | v46.35,44.92 U1.34 P2.34 33.65,44.92 v32.38,43.65 | P1.C25 12.06,30.95 v32.38,30.95
RDY  (via drill 0.61)
  Top 0.254: P1.A26 4.44,28.41 4.44,30.95 8.25,30.95 v8.25,47.46 | v12.06,48.73 15.87,52.54 v15.87,57.62
  Bottom 0.254: U1.2 P2.2 v15.87,57.62 | v8.25,47.46 9.52,48.73 v12.06,48.73
SYNC  (via drill 0.61)
  Top 0.254: P2.7 U1.7 | P1.C24 12.06,30.95 12.06,27.14 13.33,25.87 15.87,25.87 v15.87,44.92
  Bottom 0.254: v15.87,44.92 P2.7
VCC  (via drill 0.61)
  Top 0.254: IC2.16 C5.2 | C12.2 IC8.16 | IC1.12 56.51,6.82 55.24,8.09 55.24,25.87 56.51,27.14 IC1.20 C4.2 55.24,33.49 v55.24,34.76 | U1.8 P2.8 | IC9.14 C10.2 | C1.2 IC7.14 48.89,34.76 47.62,36.03 v47.62,43.65 v47.62,53.81 | C3.2 IC10.16 | P1.C3 P1.C2 12.06,89.37 12.06,91.91 | 12.06,91.91 C9.+ | IC4.10 12.06,91.91 | IC3.20 C6.2 | IC4.14 C8.2 v36.19,71.59 | C7.2 IC6.14 51.43,83.02 52.7,84.29 52.7,94.45 51.43,95.72 IC6.9 | C2.2 IC5.14 | 78.1,77.94 C11.2 | 78.1,77.94 QG1.14 | v78.1,56.35 78.1,77.94
  Bottom 0.254: IC1.12 IC2.16 | C12.2 64.13,27.14 IC1.20 | v47.62,53.81 C3.2 51.43,55.08 61.59,55.08 64.13,57.62 IC9.14 66.67,57.62 67.94,56.35 v78.1,56.35 | U1.8 32.38,42.38 33.65,43.65 v47.62,43.65 | v55.24,34.76 IC7.14 | IC4.10 37.46,91.91 38.73,90.64 41.27,90.64 42.54,89.37 IC4.4 45.08,89.37 47.62,86.83 52.7,86.83 53.97,85.56 53.97,81.75 | v36.19,71.59 27.3,71.59 26.03,70.32 IC3.20 | QG1.14 QG1.1 | C2.2 66.67,76.67 C11.2 | 53.97,81.75 52.7,81.75 51.43,83.02 IC6.14 | IC5.14 53.97,81.75 | C7.2 40,79.21 37.46,81.75 IC4.14

### Text on the board
Top: (C) A. Fachat | PET-CSADAPTER-V1.1A